# Altium schematic sheet 2 - Position2Go_Microcontroller.SchDoc
size A3; Release: RC00; PageSetup: Record=PageOptions|CenterHorizontal=True|CenterVertical=True|PrintScale=1.01|XCorrection=1.00|YCorrection=1.00|PrintKind=0|BorderSize=5000000|LeftOffset=0|BottomOffset=0|Orientation=2|PaperLength=1000|PaperWidth=1000|Scale=100|PaperSource=7|PrintQuality=-4|MediaType=1|DitherType=10|PaperKind=A3|PrintScaleMode=1; Doc_ConfidentialStatus: <Doc_ConfidentialStatus>; Doc_Preliminary: <Doc_Preliminary>
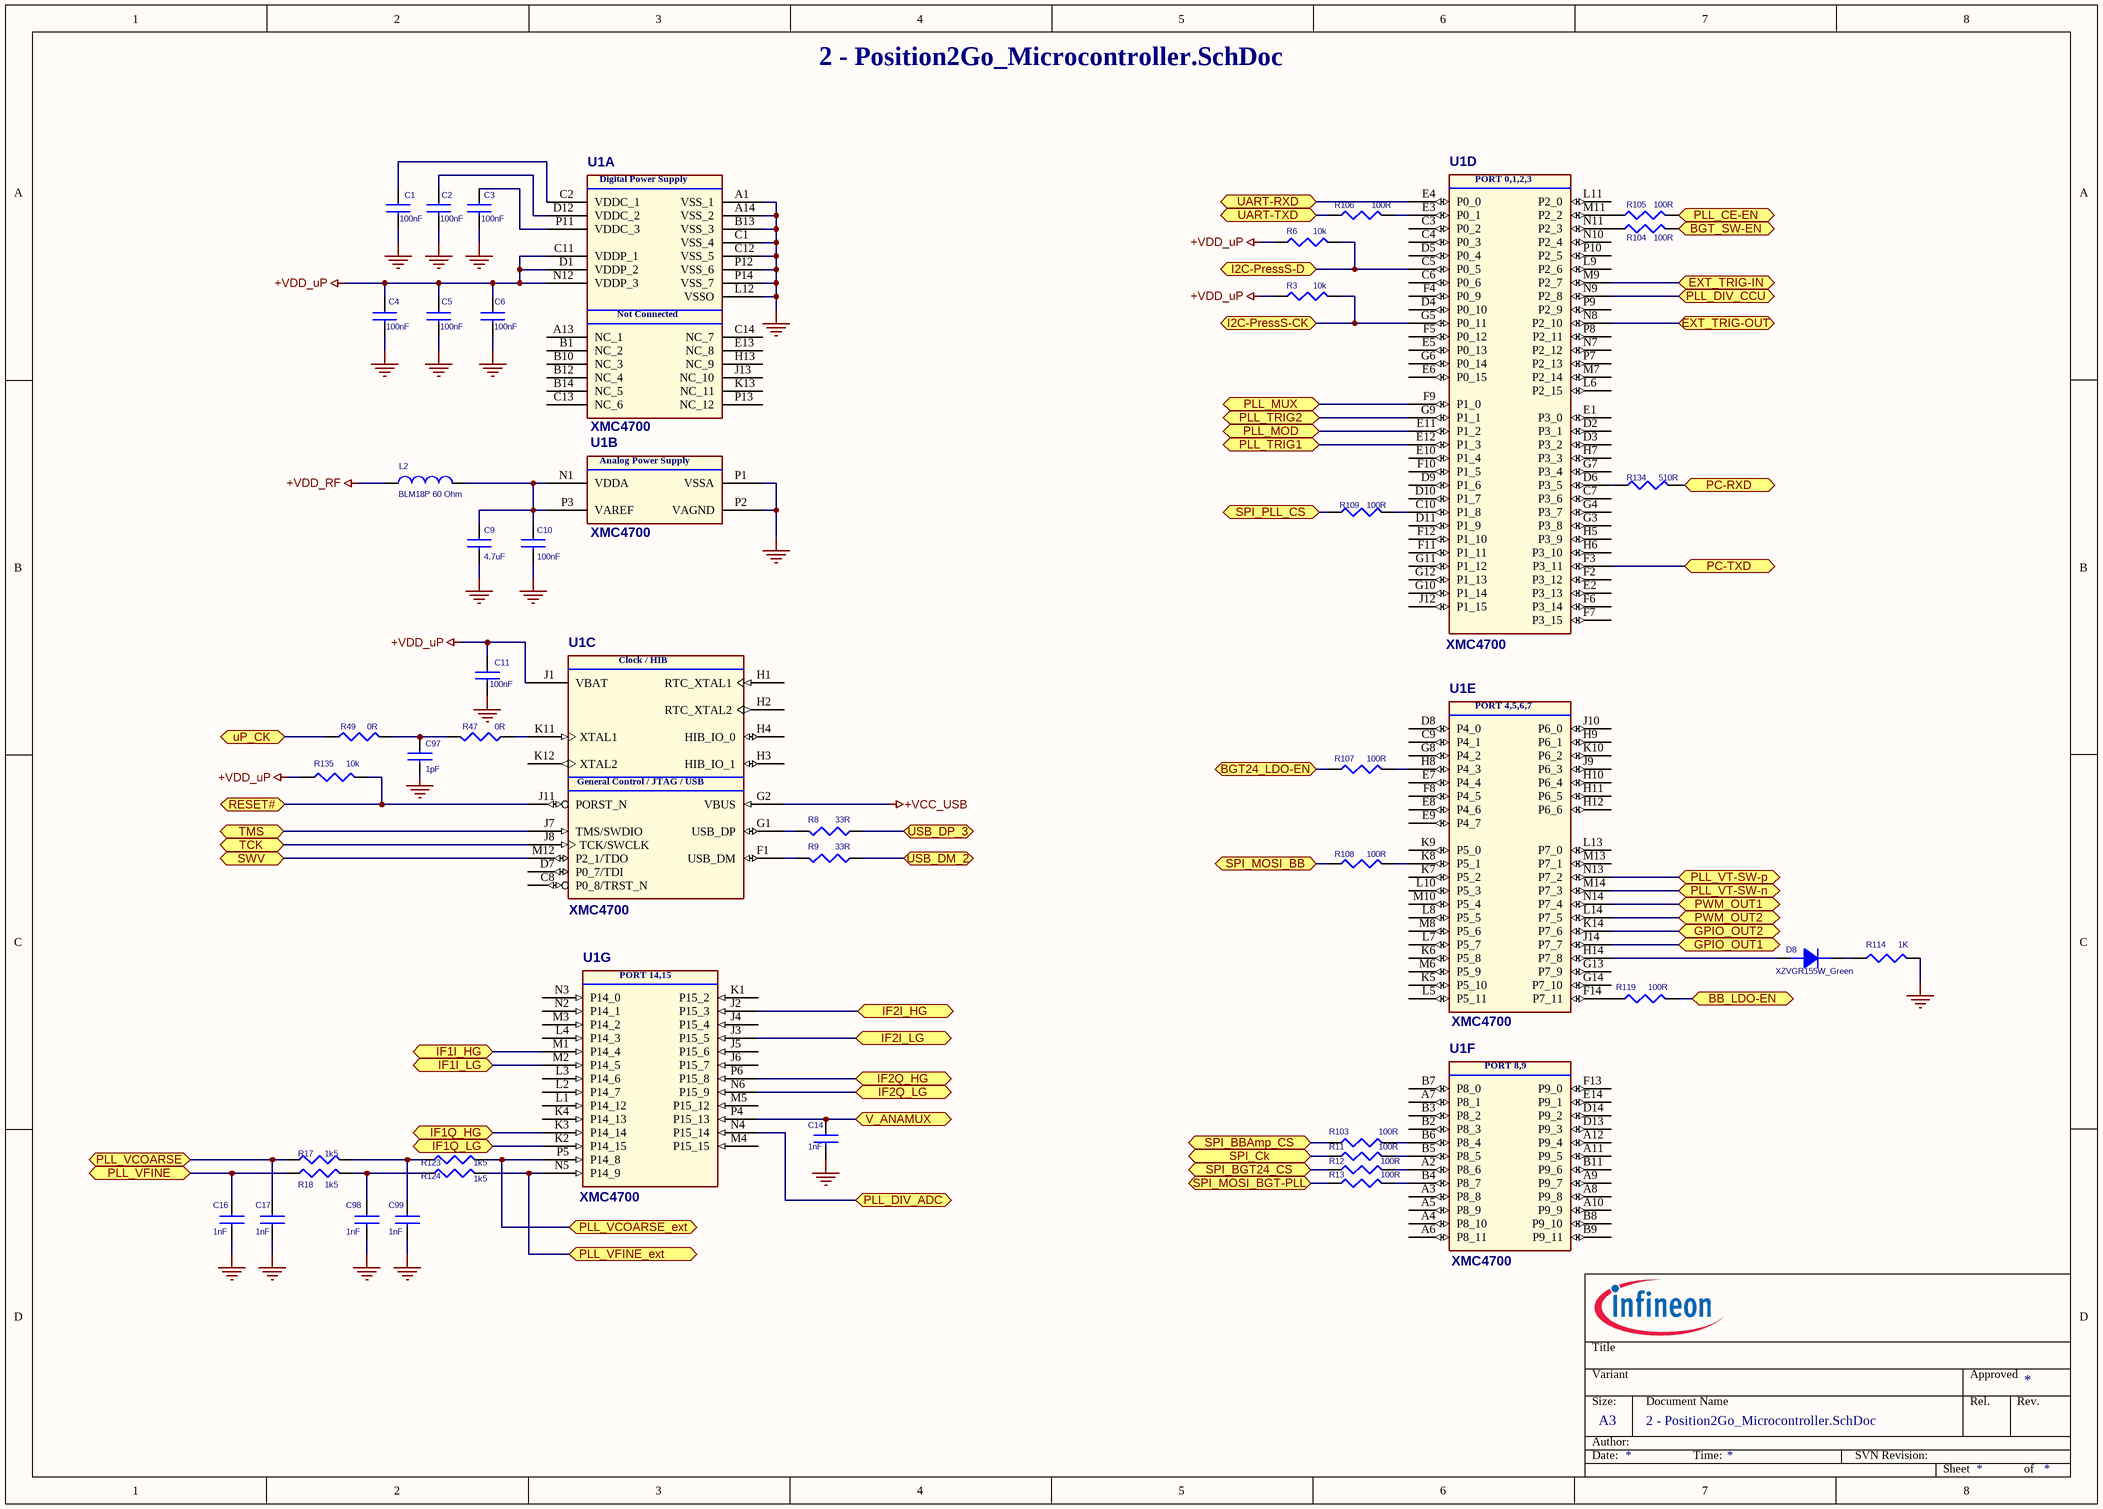
[diagram p0: 2 - Position2Go_Microcontroller.SchDoc]

## Parts
C1  100nF  [C_0201]
C2  100nF  [C_0201]
C3  100nF  [C_0201]
C4  100nF  [C_0201]
C5  100nF  [C_0201]
C6  100nF  [C_0201]
C9  4.7uF  [0402_durac]
C10  100nF  [C_0201]
C11  100nF  [C_0201]
C14  1nF  [C_0201]
C16  1nF  [C_0201]
C17  1nF  [C_0201]
C97  1pF  [C_0201]
C98  1nF  [0402_durac]
C99  1nF  [0402_durac]
D8  XZVGR155W_Green  [LED_0201]
L2  BLM18P 60 Ohm  [L_0603]
R3  10k  [R_0201]
R6  10k  [R_0201]
R8  33R  [0402_durac]
R9  33R  [0402_durac]
R11  100R  [R_0201]
R12  100R  [R_0201]
R13  100R  [R_0201]
R17  1k5  [R_0201]
R18  1k5  [R_0201]
R47  0R  [R_0201]
R49  0R  [R_0201]
R103  100R  [R_0201]
R104  100R  [R_0201]
R105  100R  [R_0201]
R106  100R  [R_0201]
R107  100R  [R_0201]
R108  100R  [R_0201]
R109  100R  [R_0201]
R114  1K  [R_0201]
R119  100R  [R_0201]
R123  1k5  [R_0201]
R124  1k5  [R_0201]
R134  510R  [0402_durac]
R135  10k  [R_0201]
U1  XMC4700  [BGA196C80P14X14_1200X1200X170]  (parts A,B,C,D,E,F,G of 7)

## Ports
BB_LDO-EN (bidir), BGT24_LDO-EN (bidir), BGT_SW-EN (bidir), EXT_TRIG-IN (bidir), EXT_TRIG-OUT (bidir), GPIO_OUT1 (bidir), GPIO_OUT2 (bidir), I2C-PressS-CK (bidir), I2C-PressS-D (bidir), IF1I_HG (bidir), IF1I_LG (bidir), IF1Q_HG (bidir), IF1Q_LG (bidir), IF2I_HG (bidir), IF2I_LG (bidir), IF2Q_HG (bidir), IF2Q_LG (bidir), PC-RXD (bidir), PC-TXD (bidir), PLL_CE-EN (bidir), PLL_DIV_ADC (bidir), PLL_DIV_CCU (bidir), PLL_MOD (bidir), PLL_MUX (bidir), PLL_TRIG1 (bidir), PLL_TRIG2 (bidir), PLL_VCOARSE (bidir), PLL_VCOARSE_ext (bidir), PLL_VFINE (bidir), PLL_VFINE_ext (bidir), PLL_VT-SW-n (bidir), PLL_VT-SW-p (bidir), PWM_OUT1 (bidir), PWM_OUT2 (bidir), RESET# (bidir), SPI_BBAmp_CS (bidir), SPI_BGT24_CS (bidir), SPI_Ck (bidir), SPI_MOSI_BB (bidir), SPI_MOSI_BGT-PLL (bidir), SPI_PLL_CS (bidir), SWV (bidir), TCK (bidir), TMS (bidir), UART-RXD (bidir), UART-TXD (bidir), uP_CK (bidir), USB_DM_2 (bidir), USB_DP_3 (bidir), V_ANAMUX (bidir)

## Nets
+VCC_USB: U1.G2(VBUS)
+VDD_RF: L2.1
+VDD_uP: C4.1 C5.1 C6.1 C11.1 R3.1 R6.2 R135.2 U1.C11(VDDP_1) U1.D1(VDDP_2) U1.J1(VBAT) U1.N12(VDDP_3)
GND_POWER: C1.2 C2.2 C3.2 C4.2 C5.2 C6.2 C9.2 C10.2 C11.2 C14.2 C16.2 C17.2 C97.2 C98.2 C99.2 R114.1 U1.A1(VSS_1) U1.A14(VSS_2) U1.B13(VSS_3) U1.C1(VSS_4) U1.C12(VSS_5) U1.L12(VSSO) U1.P1(VSSA) U1.P2(VAGND) U1.P12(VSS_6) U1.P14(VSS_7)
BB_LDO-EN: R119.1 ; port BB_LDO-EN
BGT24_LDO-EN: R107.1 ; port BGT24_LDO-EN
BGT_SW-EN: R104.2 ; port BGT_SW-EN
EXT_TRIG-IN: U1.M9(P2_7) ; port EXT_TRIG-IN
EXT_TRIG-OUT: U1.N8(P2_10) ; port EXT_TRIG-OUT
GPIO_OUT1: U1.J14(P7_7) ; port GPIO_OUT1
GPIO_OUT2: U1.K14(P7_6) ; port GPIO_OUT2
I2C-PressS-CK: R3.2 U1.G5(P0_11) ; port I2C-PressS-CK
I2C-PressS-D: R6.1 U1.C5(P0_5) ; port I2C-PressS-D
IF1I_HG: U1.M1(P14_4) ; port IF1I_HG
IF1I_LG: U1.M2(P14_5) ; port IF1I_LG
IF1Q_HG: U1.K3(P14_14) ; port IF1Q_HG
IF1Q_LG: U1.K2(P14_15) ; port IF1Q_LG
IF2I_HG: U1.J2(P15_3) ; port IF2I_HG
IF2I_LG: U1.J3(P15_5) ; port IF2I_LG
IF2Q_HG: U1.P6(P15_8) ; port IF2Q_HG
IF2Q_LG: U1.N6(P15_9) ; port IF2Q_LG
PC-RXD: R134.2 ; port PC-RXD
PC-TXD: U1.F3(P3_11) ; port PC-TXD
PLL_CE-EN: R105.2 ; port PLL_CE-EN
PLL_DIV_ADC: U1.N4(P15_14) ; port PLL_DIV_ADC
PLL_DIV_CCU: U1.N9(P2_8) ; port PLL_DIV_CCU
PLL_MOD: U1.E11(P1_2) ; port PLL_MOD
PLL_MUX: U1.F9(P1_0) ; port PLL_MUX
PLL_TRIG1: U1.E12(P1_3) ; port PLL_TRIG1
PLL_TRIG2: U1.G9(P1_1) ; port PLL_TRIG2
PLL_VCOARSE: C17.1 R17.1 ; port PLL_VCOARSE
PLL_VCOARSE_ext: R123.2 U1.P5(P14_8) ; port PLL_VCOARSE_ext
PLL_VFINE: C16.1 R18.1 ; port PLL_VFINE
PLL_VFINE_ext: R124.2 U1.N5(P14_9) ; port PLL_VFINE_ext
PLL_VT-SW-n: U1.M14(P7_3) ; port PLL_VT-SW-n
PLL_VT-SW-p: U1.N13(P7_2) ; port PLL_VT-SW-p
PWM_OUT1: U1.N14(P7_4) ; port PWM_OUT1
PWM_OUT2: U1.L14(P7_5) ; port PWM_OUT2
RESET#: R135.1 U1.J11(PORST_N) ; port RESET#
SPI_BBAmp_CS: R103.1 ; port SPI_BBAmp_CS
SPI_BGT24_CS: R12.1 ; port SPI_BGT24_CS
SPI_Ck: R11.1 ; port SPI_Ck
SPI_MOSI_BB: R108.1 ; port SPI_MOSI_BB
SPI_MOSI_BGT-PLL: R13.1 ; port SPI_MOSI_BGT-PLL
SPI_PLL_CS: R109.2 ; port SPI_PLL_CS
SWV: U1.M12(P2_1/TDO) ; port SWV
TCK: U1.J8(TCK/SWCLK) ; port TCK
TMS: U1.J7(TMS/SWDIO) ; port TMS
UART-RXD: U1.E4(P0_0) ; port UART-RXD
UART-TXD: R106.1 ; port UART-TXD
uP_CK: R49.2 ; port uP_CK
USB_DM_2: R9.1 ; port USB_DM_2
USB_DP_3: R8.1 ; port USB_DP_3
V_ANAMUX: C14.1 U1.P4(P15_13) ; port V_ANAMUX
NetC1_1: C1.1 U1.C2(VDDC_1)
NetC2_1: C2.1 U1.D12(VDDC_2)
NetC3_1: C3.1 U1.P11(VDDC_3)
NetC9_1: C9.1 C10.1 L2.2 U1.N1(VDDA) U1.P3(VAREF)
NetC97_1: C97.1 R47.2 R49.1
NetC98_1: C98.1 R18.2 R124.1
NetC99_1: C99.1 R17.2 R123.1
NetD8_1: D8.1(K) R114.2
NetD8_2: D8.2(A) U1.H14(P7_8)
NetR8_2: R8.2 U1.G1(USB_DP)
NetR9_2: R9.2 U1.F1(USB_DM)
NetR11_2: R11.2 U1.B5(P8_5)
NetR12_2: R12.2 U1.A2(P8_6)
NetR13_2: R13.2 U1.B4(P8_7)
NetR47_1: R47.1 U1.K11(XTAL1)
NetR103_2: R103.2 U1.B6(P8_4)
NetR104_1: R104.1 U1.N11(P2_3)
NetR105_1: R105.1 U1.M11(P2_2)
NetR106_2: R106.2 U1.E3(P0_1)
NetR107_2: R107.2 U1.H8(P4_3)
NetR108_2: R108.2 U1.K8(P5_1)
NetR109_1: R109.1 U1.C10(P1_8)
NetR119_2: R119.2 U1.F14(P7_11)
NetR134_1: R134.1 U1.D6(P3_5)

Not connected (* = marked no-connect by the designer): U1 A3(P8_8) A4(P8_10) A5(P8_9) A6(P8_11) A7(P8_1) A8(P9_8) A9(P9_7) A10(P9_9) A11(P9_5) A12(P9_4) A13(NC_1) B1(NC_2) B2(P8_3) B3(P8_2) B7(P8_0) B8(P9_10) B9(P9_11) B10(NC_3) B11(P9_6) B12(NC_4) B14(NC_5) C3(P0_2) C4(P0_3) C6(P0_6) C7(P3_6) C8(P0_8/TRST_N) C9(P4_1) C13(NC_6) C14(NC_7) D2(P3_1) D3(P3_2) D4(P0_10) D5(P0_4) D7(P0_7/TDI) D8(P4_0) D9(P1_6) D10(P1_7) D11(P1_9) D13(P9_3) D14(P9_2) E1(P3_0) E2(P3_13) E5(P0_13) E6(P0_15) E7(P4_4) E8(P4_6) E9(P4_7) E10(P1_4) E13(NC_8) E14(P9_1) F2(P3_12) F4(P0_9) F5(P0_12) F6(P3_14) F7(P3_15) F8(P4_5) F10(P1_5) F11(P1_11) F12(P1_10) F13(P9_0) G3(P3_8) G4(P3_7) G6(P0_14) G7(P3_4) G8(P4_2) G10(P1_14) G11(P1_12) G12(P1_13) G13(P7_9) G14(P7_10) H1(RTC_XTAL1) H2(RTC_XTAL2) H3(HIB_IO_1) H4(HIB_IO_0) H5(P3_9) H6(P3_10) H7(P3_3) H9(P6_1) H10(P6_4) H11(P6_5) H12(P6_6) H13(NC_9) J4(P15_4) J5(P15_6) J6(P15_7) J9(P6_3) J10(P6_0) J12(P1_15) J13(NC_10) K1(P15_2) K4(P14_13) K5(P5_10) K6(P5_8) K7(P5_2) K9(P5_0) K10(P6_2) K12(XTAL2) K13(NC_11) L1(P14_12) L2(P14_7) L3(P14_6) L4(P14_3) L5(P5_11) L6(P2_15) L7(P5_7) L8(P5_5) L9(P2_6) L10(P5_3) L11(P2_0) L13(P7_0) M3(P14_2) M4(P15_15) M5(P15_12) M6(P5_9) M7(P2_14) M8(P5_6) M10(P5_4) M13(P7_1) N2(P14_1) N3(P14_0) N7(P2_12) N10(P2_4) P7(P2_13) P8(P2_11) P9(P2_9) P10(P2_5) P13(NC_12)

## Notes on the sheet
- Title
- Variant
- Approved
- Date:
- Author:
- Size:
- A3
- Document Name
- Time:
- SVN Revision:
- Rel.
- Rev.
- Sheet
- of
- (in symbol XMC4700-E196F2048, part A) Digital Power Supply; Not Connected
- (in symbol XMC4700-E196F2048, part B) Analog Power Supply
- (in symbol XMC4700-E196F2048, part C) Clock / HIB; General Control / JTAG / USB
- (in symbol XMC4700-E196F2048, part D) PORT 0,1,2,3
- (in symbol XMC4700-E196F2048, part E) PORT 4,5,6,7
- (in symbol XMC4700-E196F2048, part F) PORT 8,9
- (in symbol XMC4700-E196F2048, part G) PORT 14,15

## Library data of the parts
C1-C6 C10 C11 = 100nF_Dup1: 100nF  ±10%  35V  X5R; code_DK: 490-10430-1-ND; Voltage: 35V; Part Type: capacitor\ceramic; Tolerance: 10%
C9 = 4.7UF: code_DK: 445-13820-1-ND; Voltage: 10V; Tolerance: 10%; Temperature coefficient: X5R; Part Type: capacitor\ceramic
C14 C16 C17 = 1nF: Tolerance: 10%; Voltage: 25V; code_DK: 445-4695-1-ND; Part Type: capacitor\ceramic
C97 = 1pF: Tolerance: ±0,1 pF; Voltage: 25V; code_DK: 712-1181-1-ND; Part Type: capacitor\ceramic
C98 C99 = 1.0nF: code_DK: 490-3244-2-ND; Voltage: 50V; Tolerance: 5%; Temperature coefficient: NP0; code_GW: GW_0144; Part Type: capacitor\ceramic; code_DK_Reel: 490-3244-2-ND
D8 = LED_0201_GREEN: code_DK_reel: 475-1193-6-ND; code_DK: 1497-1300-1-ND
L2 = blm18 p 60 ohm: code_DK: 490-1036-1-ND
R3 R6 R135 = 10K_Dup1: code_DK_reel: 311-1KMDKR-ND; code_DK: 311-10.0KMCT-ND; tolerance: 1%; Power: 0.063W; size: 0201
R8 R9 = RESISTOR: code_DK: 311-33.0LRTR-ND
R11-R13 R103-R109 R119 = 100: code_DK: 311-100MCT-ND; tolerance: 1%; Power: 0.063W; size: 0201
R17 R18 R123 R124 = 1k5: tolerance: 1%; Power: 0.063W; size: 0201
R47 R49 = 0_Dup2: code_DK: 311-0.0NCT-ND; tolerance: 1%; Power: 0.063W; size: 0201
R114 = 1K: Power: 0.063W; tolerance: 1%; code_DK: 311-1KMCT-ND; size: 0201
R134 = 510: Power: 0.063W; tolerance: 1%; code_DK: 311-510LRTR-ND; size: 0402
U1 = XMC4700-E196F2048: code_DK: XMC4700E196K2048AAXQMA1-ND